# EAGLE design SMART DISPENSER RELAY (EAGLE 9.6.2)
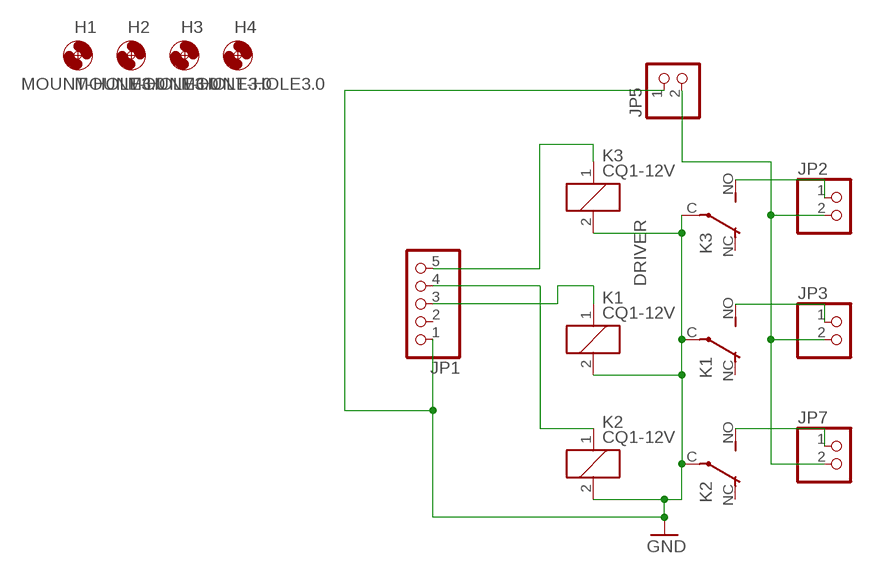
[diagram p0: schematic, sheet 1]

## Parts
H1  MOUNT-HOLE3.0  [3,0]
H2  MOUNT-HOLE3.0  [3,0]
H3  MOUNT-HOLE3.0  [3,0]
H4  MOUNT-HOLE3.0  [3,0]
JP1  PINHD-1X5  [1X05]
JP2  PINHD-1X2  [1X02]
JP3  PINHD-1X2  [1X02]
JP5  PINHD-1X2  [1X02]
JP7  PINHD-1X2  [1X02]
K1  CQ1-12V  [CQ1]
K2  CQ1-12V  [CQ1]
K3  CQ1-12V  [CQ1]

## Nets
GND: JP1.1 JP5.1 K1.2 K1.C(2:P) K2.2 K2.C(2:P) K3.2 K3.C(2:P)
N$1: JP1.5 K3.1
N$2: JP7.1 K2.NO(2:S)
N$3: JP1.3 K1.1
N$4: JP1.4 K2.1
N$5: JP2.2 JP3.2 JP5.2 JP7.2
N$8: JP3.1 K1.NO(2:S)
N$9: JP2.1 K3.NO(2:S)
Unconnected: JP1.2 K1.NC(2:O) K2.NC(2:O) K3.NC(2:O)

## Notes on the sheet
- DRIVER

## Library data of the parts
H1-H4 = holes:MOUNT-HOLE: MOUNTING HOLE with drill center marker
JP1 = pinhead:PINHD-1X5: PIN HEADER
JP2 JP3 JP5 JP7 = pinhead:PINHD-1X2: PIN HEADER
K1-K3 = relay:CQ1-12V: AUTOMOTIVE QUIET RELAY NAiS Source: http://www.mew-europe.com/.. en_ds_61208_0000.pdf; OC_FARNELL: unknown; OC_NEWARK: unknown

## Board
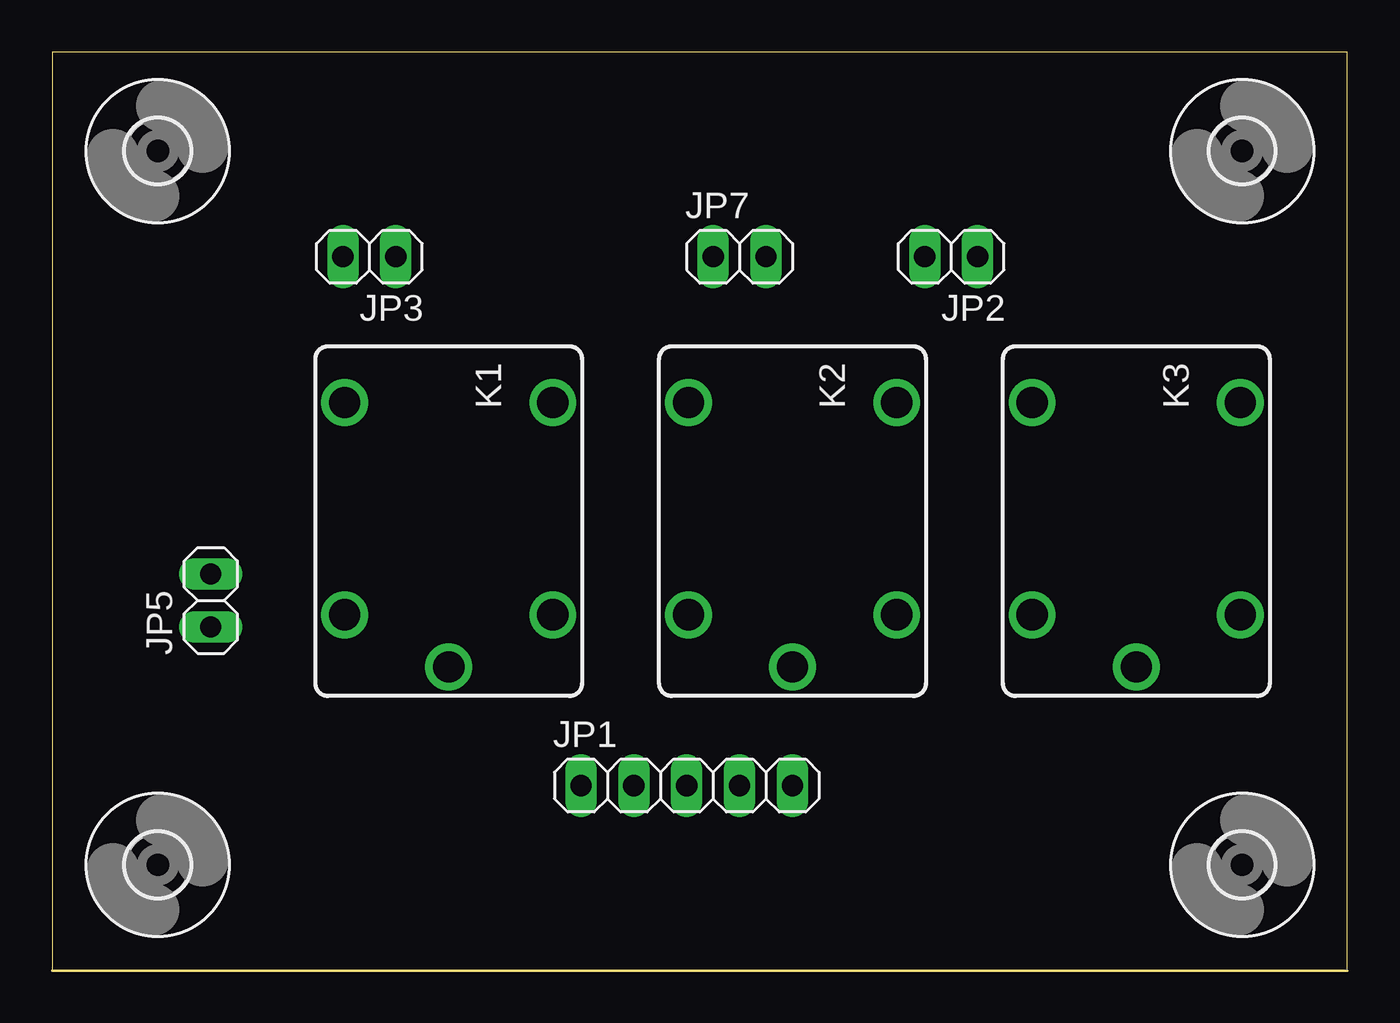
[diagram p1: board, top side]
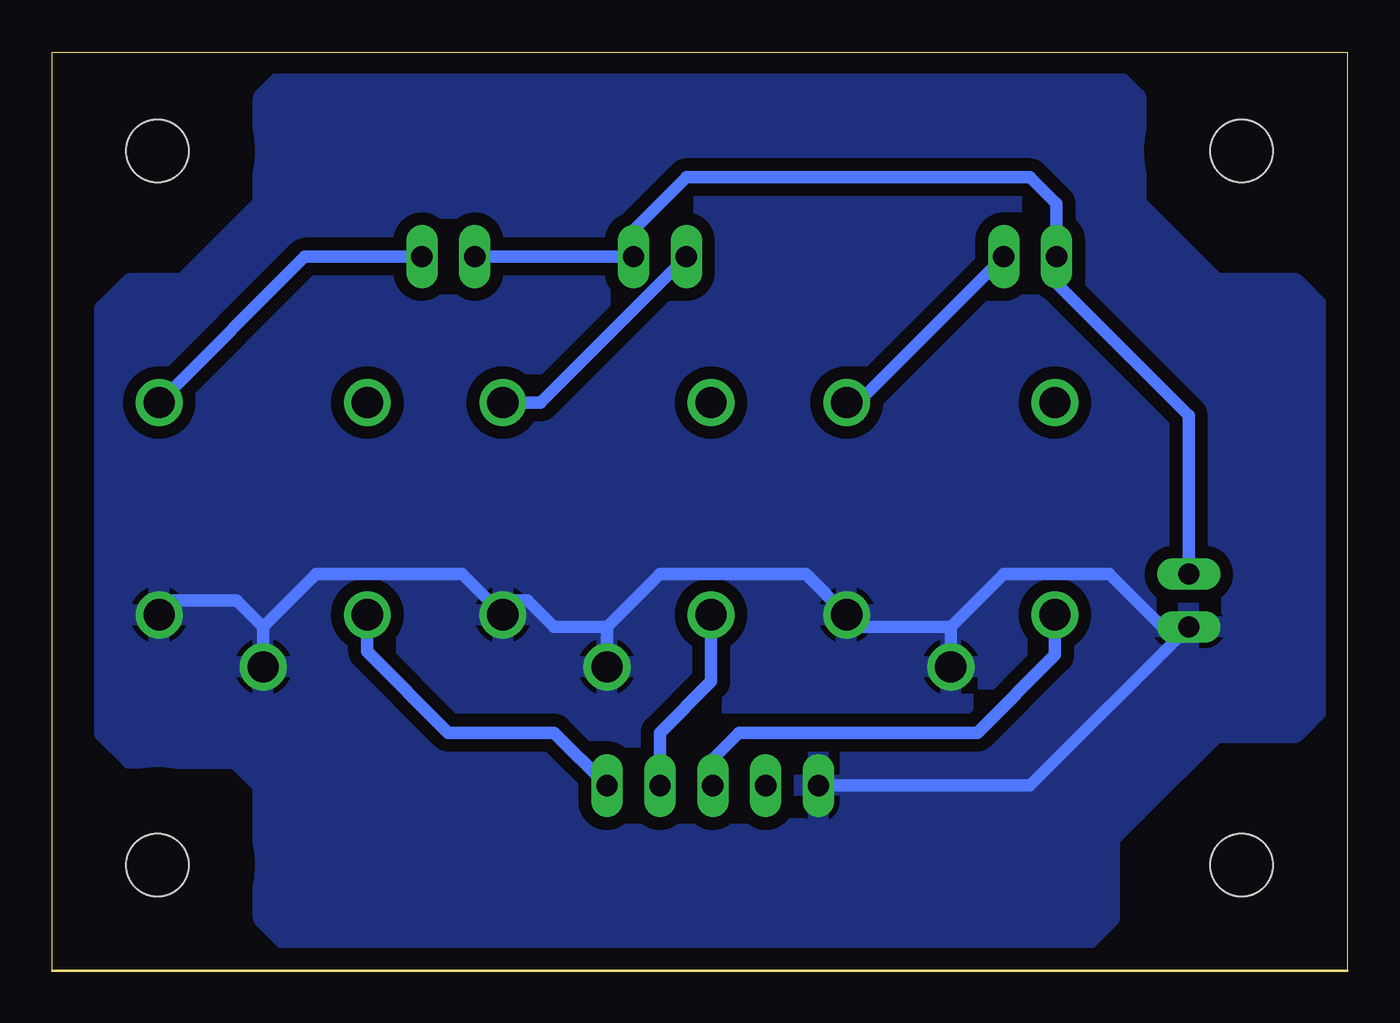
[diagram p2: board, bottom side, seen from below]

Size 62.21 x 44.12 mm. Coordinates in mm from the lower left corner, seen from the top.
Outline: 0,0 62.21,0 62.21,44.12 0,44.12 0,0
Copper layers (1*16): Top 0.035mm / dielectric 1.5mm / Bottom 0.035mm
Design rules "default": minimum track width 6mil, minimum drill 0.35mm, track to track 6mil, track to pad 6mil, pad to pad 6mil, via to via 6mil, smd to smd 6mil, copper to edge 40mil, drill to drill 6mil, minimum pad ring 10mil, minimum via ring 8mil, stop-mask expansion 4mil, vias tented up to drill 0mil, thermal gap 10mil

### Footprints (pad centres in the part's own frame; a part is rotated, then mirrored left to right if it is on the bottom)
3,0 = hole 3: 0,0
1X05 = drill 1.016 long: 1 -5.08,0; 2 -2.54,0; 3 0,0; 4 2.54,0; 5 5.08,0
1X02 = drill 1.016 long: 1 -1.27,0; 2 1.27,0
CQ1 = drill 1.5: 1 4.5,-5; 2 4.5,5; C 7,0; NC -5.7,-5; NO -5.7,5

### Placement (x,y rotation side)
H1  5.08,5.08 0 top
H2  57.15,5.08 0 top
H3  57.15,39.37 0 top
H4  5.08,39.37 0 top
JP1  30.48,8.89 0 top
JP2  43.18,34.29 180 top
JP3  15.24,34.29 180 top
JP5  7.62,17.78 90 top
JP7  33.02,34.29 0 top
K1  19.05,21.59 270 top
K2  35.56,21.59 270 top
K3  52.07,21.59 270 top

### Tracks (layer width: path | path; a pad name or v marks a point on that pad's centre or on a via)
GND
  Bottom 0.61: 19.05,16.51 16.51,19.05 11.43,19.05 8.89,16.51 JP5.1 15.24,8.89 JP1.1 | 19.05,16.51 K1.C | 19.05,16.51 23.47,16.51 K1.2 26.01,19.05 33.02,19.05 35.56,16.51 | 35.56,16.51 K2.C | 35.56,16.51 38.1,16.51 39.37,17.78 40.64,17.78 40.64,17.17 K2.2 42.52,19.05 49.53,19.05 52.07,16.51 | K3.C 52.07,16.51 | 52.07,16.51 53.34,17.78 56.38,17.78 K3.2
  pour Bottom (isolate 0.61): 5.08,11.43 6.35,11.43 10.16,7.62 11.43,6.35 11.43,2.54 12.7,1.27 49.53,1.27 50.8,1.27 52.07,2.54 52.07,8.89 53.34,10.16 58.42,10.16 59.69,11.43 59.69,30.48 59.69,31.75 58.42,33.02 55.88,33.02 52.07,36.83 52.07,39.37 52.07,41.91 50.8,43.18 11.43,43.18 10.16,41.91 10.16,39.37 10.16,36.83 6.35,33.02 2.54,33.02 1.27,31.75 1.27,13.97 1.27,12.7 2.54,11.43
N$1
  Top 0.152: K3.1 46.99,17.01
  Bottom 0.61: JP1.5 38.1,11.43 43.18,11.43 47.07,15.32 K3.1
N$2
  Bottom 0.61: JP7.1 38.75,27.29 K2.NO
N$3
  Bottom 0.61: K1.1 14.05,15.16 17.78,11.43 29.21,11.43 30.48,10.16 JP1.3
N$4
  Bottom 0.61: K2.1 30.56,13.89 33.02,11.43 JP1.4
N$5
  Bottom 0.61: JP5.2 7.62,26.67 13.97,33.02 JP3.2 13.97,36.83 15.24,38.1 31.75,38.1 34.29,35.56 JP7.2 JP2.2
N$8
  Top 0.61: 24.13,27.37 K1.NO
  Bottom 0.61: JP3.1 23.51,27.29 K1.NO
N$9
  Top 0.61: 57.15,27.37 K3.NO
  Bottom 0.61: JP2.1 50.07,34.29 K3.NO